# Altium project ESP-IOT.PrjPcb
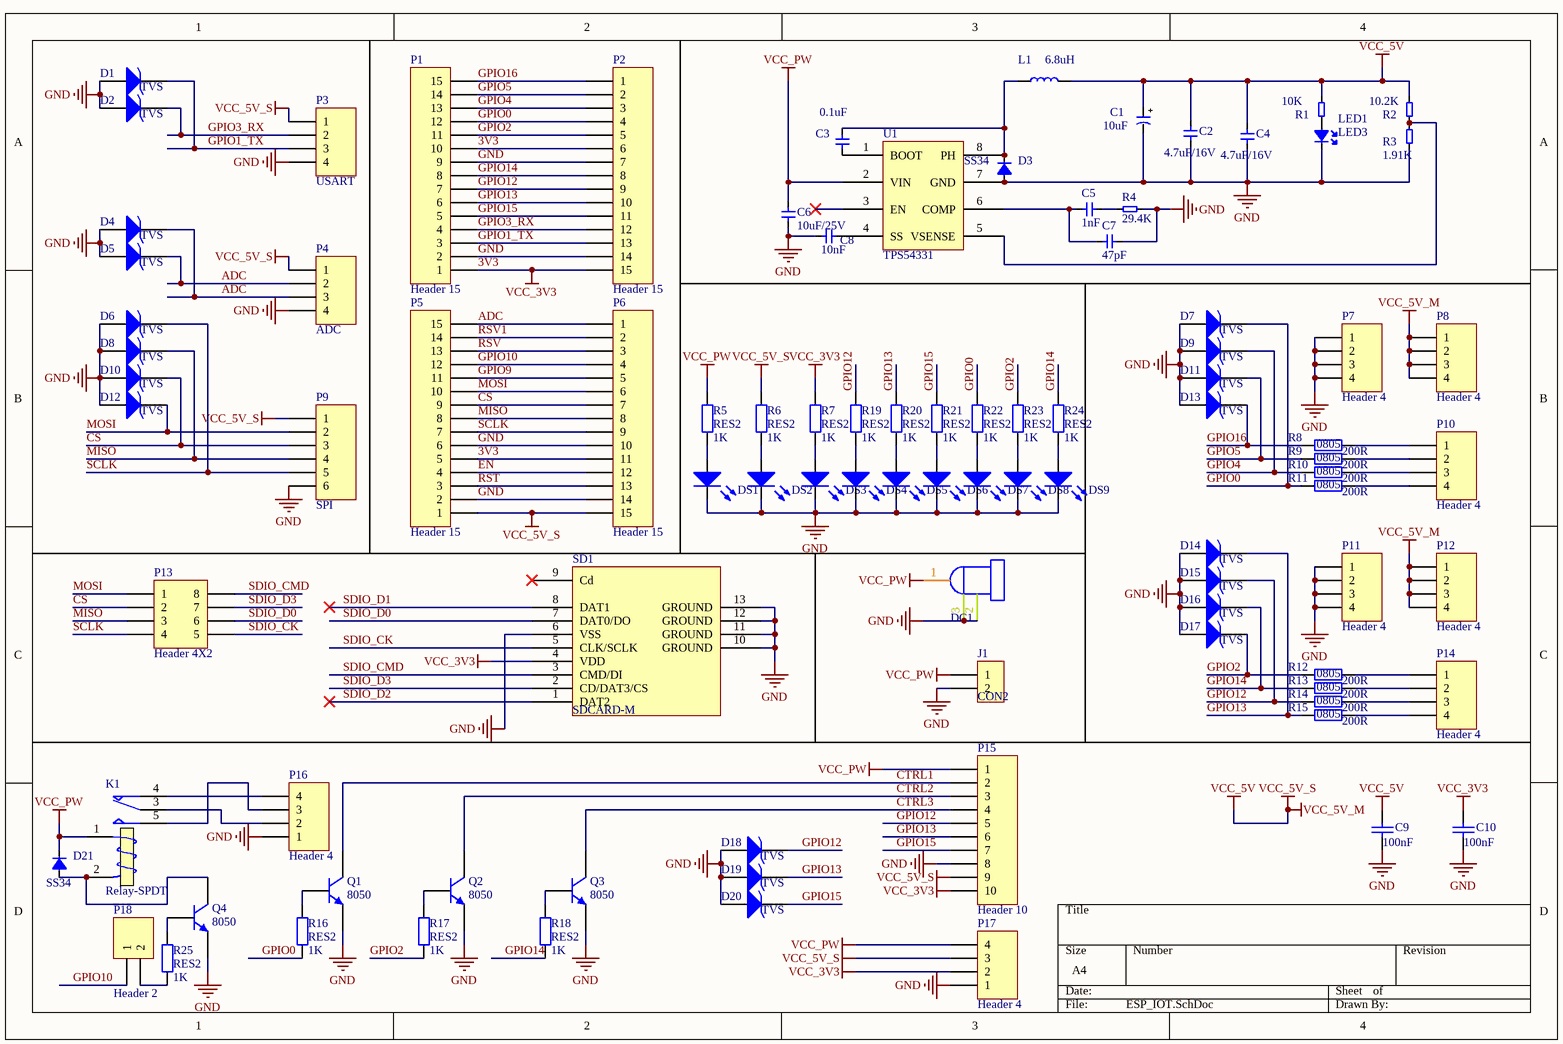
[diagram p0: ESP_IOT.SchDoc]
1 sheet, 94 parts. Net scope: global (net labels, ports and power ports of the same name join across sheets).
Board file: ESP12Fuint.PcbDoc

## Sheet ESP_IOT.SchDoc
size A4; DocumentNumber: 1; SheetNumber: 1; SheetTotal: 1

### Parts
C1  10uF  [3528]
C2  4.7uF/16V  [0603C]
C3  0.1uF  [0603C]
C4  4.7uF/16V  [0603C]
C5  1nF  [0603C]
C6  10uF/25V  [1206]
C7  47pF  [0603C]
C8  10nF  [0603C]
C9  value 100nF  [C 0603_L]  (hidden comment: CAP)
C10  value 100nF  [C 0603_L]  (hidden comment: CAP)
D1  TVS  [SOD-523]
D2  TVS  [SOD-523]
D3  SS34  [DO-214AC-SMA]
D4  TVS  [SOD-523]
D5  TVS  [SOD-523]
D6  TVS  [SOD-523]
D7  TVS  [SOD-523]
D8  TVS  [SOD-523]
D9  TVS  [SOD-523]
D10  TVS  [SOD-523]
D11  TVS  [SOD-523]
D12  TVS  [SOD-523]
D13  TVS  [SOD-523]
D14  TVS  [SOD-523]
D15  TVS  [SOD-523]
D16  TVS  [SOD-523]
D17  TVS  [SOD-523]
D18  TVS  [SOD-523]
D19  TVS  [SOD-523]
D20  TVS  [SOD-523]
D21  SS34  [DO-214AC-SMA]
DC1  DC  [DC-005]  (value not drawn)
DS1  LED  [LED 0805B]  (value not drawn)
DS2  LED  [LED 0805B]  (value not drawn)
DS3  LED  [LED 0805B]  (value not drawn)
DS4  LED  [LED 0805B]  (value not drawn)
DS5  LED  [LED 0805B]  (value not drawn)
DS6  LED  [LED 0805B]  (value not drawn)
DS7  LED  [LED 0805B]  (value not drawn)
DS8  LED  [LED 0805B]  (value not drawn)
DS9  LED  [LED 0805B]  (value not drawn)
J1  CON2  [DG1282-5.0]
K1  Relay-SPDT  [SRD-C_B]
L1  6.8uH  [L100]
LED1  LED3  [0603-led]
P1  Header 15  [HDR1X15]
P2  Header 15  [HDR1X15]
P3  USART  [KF2EDGK-2.54-WI-4P]
P4  ADC  [KF2EDGK-2.54-WI-4P]
P5  Header 15  [HDR1X15]
P6  Header 15  [HDR1X15]
P7  Header 4  [HDR2.54-LI-4P]
P8  Header 4  [HDR2.54-LI-4P]
P9  SPI  [KF2EDGK-2.54-WI-6P]
P10  Header 4  [HDR2.54-LI-4P]
P11  Header 4  [HDR2.54-LI-4P]
P12  Header 4  [HDR2.54-LI-4P]
P13  Header 4X2  [CSW1.27 SMD-4P]
P14  Header 4  [HDR2.54-LI-4P]
P15  Header 10  [KF2EDGK-2.54-WI-10P]
P16  Header 4  [COM4_8]
P17  Header 4  [COM4_8]
P18  Header 2  [HDR2.54-LI-2P]
Q1  8050  [SOT23-3L]
Q2  8050  [SOT23-3L]
Q3  8050  [SOT23-3L]
Q4  8050  [SOT23-3L]
R1  10K  [0603]
R2  10.2K  [0603]
R3  1.91K  [0603]
R4  29.4K  [0603]
R5  RES2  value 1K  [R 0805_L]
R6  RES2  value 1K  [R 0805_L]
R7  RES2  value 1K  [R 0805_L]
R8  0805  value 200R  [R 0805_L]
R9  0805  value 200R  [R 0805_L]
R10  0805  value 200R  [R 0805_L]
R11  0805  value 200R  [R 0805_L]
R12  0805  value 200R  [R 0805_L]
R13  0805  value 200R  [R 0805_L]
R14  0805  value 200R  [R 0805_L]
R15  0805  value 200R  [R 0805_L]
R16  RES2  value 1K  [R 0805_L]
R17  RES2  value 1K  [R 0805_L]
R18  RES2  value 1K  [R 0805_L]
R19  RES2  value 1K  [R 0805_L]
R20  RES2  value 1K  [R 0805_L]
R21  RES2  value 1K  [R 0805_L]
R22  RES2  value 1K  [R 0805_L]
R23  RES2  value 1K  [R 0805_L]
R24  RES2  value 1K  [R 0805_L]
R25  RES2  value 1K  [R 0805_L]
SD1  SDCARD-M  [SDCARD-M]
U1  TPS54331  [SO08]

### Nets
3V3: C10.2 P1.1 P1.10 P2.6 P2.15 P5.5 P6.11 P15.10 P17.2 R7.2 SD1.4(VDD)  [also labelled VCC_3V3]
GND: C1.2 C2.1 C4.1 C6.1 C7.2 C8.2 C9.1 C10.1 D1.1(A) D2.1(A) D3.1(A) D4.1(A) D5.1(A) D6.1(A) D7.1(A) D8.1(A) D9.1(A) D10.1(A) D11.1(A) D12.1(A) D13.1(A) D14.1(A) D15.1(A) D16.1(A) D17.1(A) D18.1(A) D19.1(A) D20.1(A) DC1.2(-) DC1.3(-) DS1.2(K) DS2.2(K) DS3.2(K) DS4.2(K) DS5.2(K) DS6.2(K) DS7.2(K) DS8.2(K) DS9.2(K) J1.2 LED1.2(K) P1.2 P1.9 P2.7 P2.14 P3.4 P4.4 P5.2 P5.6 P6.10 P6.14 P7.1 P7.2 P7.3 P7.4 P9.6 P11.1 P11.2 P11.3 P11.4 P15.8 P16.1 P17.1 Q1.2(E) Q2.2(E) Q3.2(E) Q4.2(E) R3.1 R4.1 SD1.6(VSS) SD1.10(GROUND) SD1.11(GROUND) SD1.12(GROUND) SD1.13(GROUND) U1.7(GND)
VCC_5V: C1.1 C2.2 C4.2 C9.2 L1.1 P3.1 P4.1 P5.1 P6.15 P8.1 P8.2 P8.3 P8.4 P9.1 P12.1 P12.2 P12.3 P12.4 P15.9 P17.3 R1.2 R2.2 R6.2  [also labelled VCC_5V_M, VCC_5V_S]
VCC_PW: C6.2 D21.2(K) DC1.1(+) J1.1 K1.1(T1) P15.1 P17.4 R5.2 U1.2(VIN)
ADC: D4.2(K) D5.2(K) P4.2 P4.3 P5.15 P6.1
CS: D10.2(K) P5.9 P6.7 P9.3 P13.2
CTRL1: P15.2 Q1.3(C)
CTRL2: P15.3 Q2.3(C)
CTRL3: P15.4 Q3.3(C)
EN: P5.4 P6.12
GPIO0: D7.2(K) P1.12 P2.4 R11.1 R16.2 R22.2
GPIO1_TX: D1.2(K) P1.3 P2.13 P3.3
GPIO2: D17.2(K) P1.11 P2.5 R12.1 R17.2 R23.2
GPIO3_RX: D2.2(K) P1.4 P2.12 P3.2
GPIO4: D9.2(K) P1.13 P2.3 R10.1
GPIO5: D11.2(K) P1.14 P2.2 R9.1
GPIO9: P5.11 P6.5
GPIO10: P5.12 P6.4 P18.1
GPIO12: D15.2(K) D18.2(K) P1.7 P2.9 P15.5 R14.1 R19.2
GPIO13: D14.2(K) D19.2(K) P1.6 P2.10 P15.6 R15.1 R20.2
GPIO14: D16.2(K) P1.8 P2.8 R13.1 R18.2 R24.2
GPIO15: D20.2(K) P1.5 P2.11 P15.7 R21.2
GPIO16: D13.2(K) P1.15 P2.1 R8.1
MISO: D8.2(K) P5.8 P6.8 P9.4 P13.3
MOSI: D12.2(K) P5.10 P6.6 P9.2 P13.1
RST: P5.3 P6.13
RSV: P5.13 P6.3
RSV1: P5.14 P6.2
SCLK: D6.2(K) P5.7 P6.9 P9.5 P13.4
SDIO_CK: P13.5 SD1.5(CLK/SCLK)
SDIO_CMD: P13.8 SD1.3(CMD/DI)
SDIO_D0: P13.6 SD1.7(DAT0/DO)
SDIO_D1: SD1.8(DAT1)
SDIO_D2: SD1.1(DAT2)
SDIO_D3: P13.7 SD1.2(CD/DAT3/CS)
NetC3_1: C3.1 U1.1(BOOT)
NetC3_2: C3.2 D3.2(K) L1.2 U1.8(PH)
NetC5_1: C5.1 R4.2
NetC5_2: C5.2 C7.1 U1.6(COMP)
NetC8_1: C8.1 U1.4(SS)
NetD21_1: D21.1(A) K1.2(T2) Q4.3(C)
NetDS1_1: DS1.1(A) R5.1
NetDS2_1: DS2.1(A) R6.1
NetDS3_1: DS3.1(A) R7.1
NetDS4_1: DS4.1(A) R19.1
NetDS5_1: DS5.1(A) R20.1
NetDS6_1: DS6.1(A) R21.1
NetDS7_1: DS7.1(A) R22.1
NetDS8_1: DS8.1(A) R23.1
NetDS9_1: DS9.1(A) R24.1
NetK1_3: K1.3(COM) P16.2
NetK1_4: K1.4(NC) P16.4
NetK1_5: K1.5(NO) P16.3
NetLED1_1: LED1.1(A) R1.1
NetP10_1: P10.1 R8.2
NetP10_2: P10.2 R9.2
NetP10_3: P10.3 R10.2
NetP10_4: P10.4 R11.2
NetP14_1: P14.1 R12.2
NetP14_2: P14.2 R13.2
NetP14_3: P14.3 R14.2
NetP14_4: P14.4 R15.2
NetP18_2: P18.2 R25.2
NetQ1_1: Q1.1(B) R16.1
NetQ2_1: Q2.1(B) R17.1
NetQ3_1: Q3.1(B) R18.1
NetQ4_1: Q4.1(B) R25.1
NetR2_1: R2.1 R3.2 U1.5(VSENSE)

Not connected (* = marked no-connect by the designer): SD1 9(Cd)*; U1 3(EN)*

### Notes on the sheet
- (in symbol CAP-+) +

### Library data of the parts
C1 = CAP-+: Capacitor
C2 C4 C6-C8 = CAP1: Capacitor
C3 C5 = CAP1: Capacitor; 类型: 电容
D1 D2 D4-D20 = D: High Conductance Fast Diode; Published: 8-Jun-2000; LatestRevisionDate: 17-Jul-2002; LatestRevisionNote: Re-released for DXP Platform.; DatasheetVersion: 1997; PackageReference: DO-35; Publisher: Altium Limited; PackageDescription: Diode, Axial; Body 3.8 x 1.9 mm (LxDia. max), Lead Dia. 0.53 mm (max); Code_JEDEC: DO-204-AH; ComponentLink1Description: Manufacturer Link; ComponentLink1URL: http://www.fairchildsemi.com/; ComponentLink2Description: Datasheet; ComponentLink2URL: http://www.fairchildsemi.com/ds/1N%2F1N4148.pdf
D3 D21 = DIOLED_1: DIODE LED
K1 = Relay-SPDT: Single-Pole Dual-Throw Relay; Published: 24-Mar-1999; LatestRevisionDate: 17-Jul-2002; LatestRevisionNote: Re-released for DXP Platform.; PackageReference: MODULE5B; Publisher: Altium Limited
L1 = INDUCTOR1_1
LED1 = CP_DIOLED: DIODE LED
P1 P2 P5 P6 = Header 15: Header, 15-Pin; LatestRevisionDate: 17-Jul-2002; LatestRevisionNote: Re-released for DXP Platform.; Publisher: Altium Limited
P3 P4 P7 P8 P10-P12 P14 P16 P17 = Header 4: Header, 4-Pin; LatestRevisionDate: 17-Jul-2002; LatestRevisionNote: Re-released for DXP Platform.; Publisher: Altium Limited
P9 = Header 6: Header, 6-Pin; LatestRevisionDate: 17-Jul-2002; LatestRevisionNote: Re-released for DXP Platform.; Publisher: Altium Limited
P13 = Header 4X2: Header, 4-Pin, Dual row; LatestRevisionDate: 17-Jul-2002; LatestRevisionNote: Re-released for DXP Platform.; Publisher: Altium Limited
P15 = Header 10: Header, 10-Pin; LatestRevisionDate: 17-Jul-2002; LatestRevisionNote: Re-released for DXP Platform.; Publisher: Altium Limited
P18 = Header 2: Header, 2-Pin; LatestRevisionDate: 17-Jul-2002; LatestRevisionNote: Re-released for DXP Platform.; Publisher: Altium Limited
Q1-Q4 = NPN  SOT: NPN Bipolar Transistor; Published: 8-Jun-2000; LatestRevisionDate: 17-Jul-2002; LatestRevisionNote: Re-released for DXP Platform.; PackageReference: TO-226-AA; Publisher: Altium Limited; PackageDescription: TO, Flat Index; 3 In-Line, Axial Leads; Body Dia. 4.8mm; Leads 0.55 x 0.51 mm (max); Code_JEDEC: TO-226-AA
R1-R4 = RES2
R5-R25 = RES2: Resistor; Published: 8-Jun-2000; LatestRevisionDate: 17-Jul-2002; LatestRevisionNote: Re-released for DXP Platform.; PackageReference: AXIAL-0.3; Publisher: Altium Limited; PackageDescription: Axial Device, Thru-Hole; 2 Leads; 0.3 in Pin Spacing
SD1 = SDCARD-M: TF卡槽